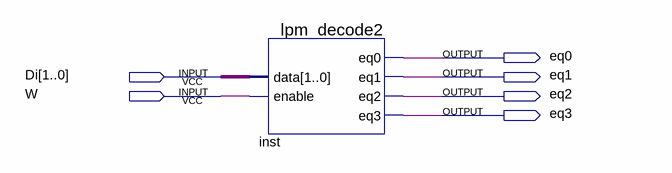
[diagram p0: schematic sheet]
// Quartus schematic test_enable_decode.bdf as structural Verilog: 1 symbols, 6 pins
module test_enable_decode (
  input  [1:0] Di,
  input  W,
  output eq0,
  output eq1,
  output eq2,
  output eq3
);

  lpm_decode2 inst (.data(Di), .enable(W), .eq0(eq0), .eq1(eq1), .eq2(eq2), .eq3(eq3));
endmodule
